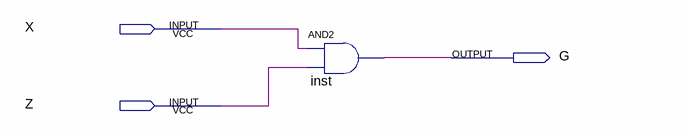
[diagram p0: schematic sheet]
// Quartus schematic Circuito-G.bdf as structural Verilog: 1 symbols, 3 pins
module \Circuito-G  (
  input  X,
  input  Z,
  output G
);

  and inst (G, X, Z);
endmodule
